# EAGLE design SSR 16 Output_1layer (EAGLE 7.6.0)
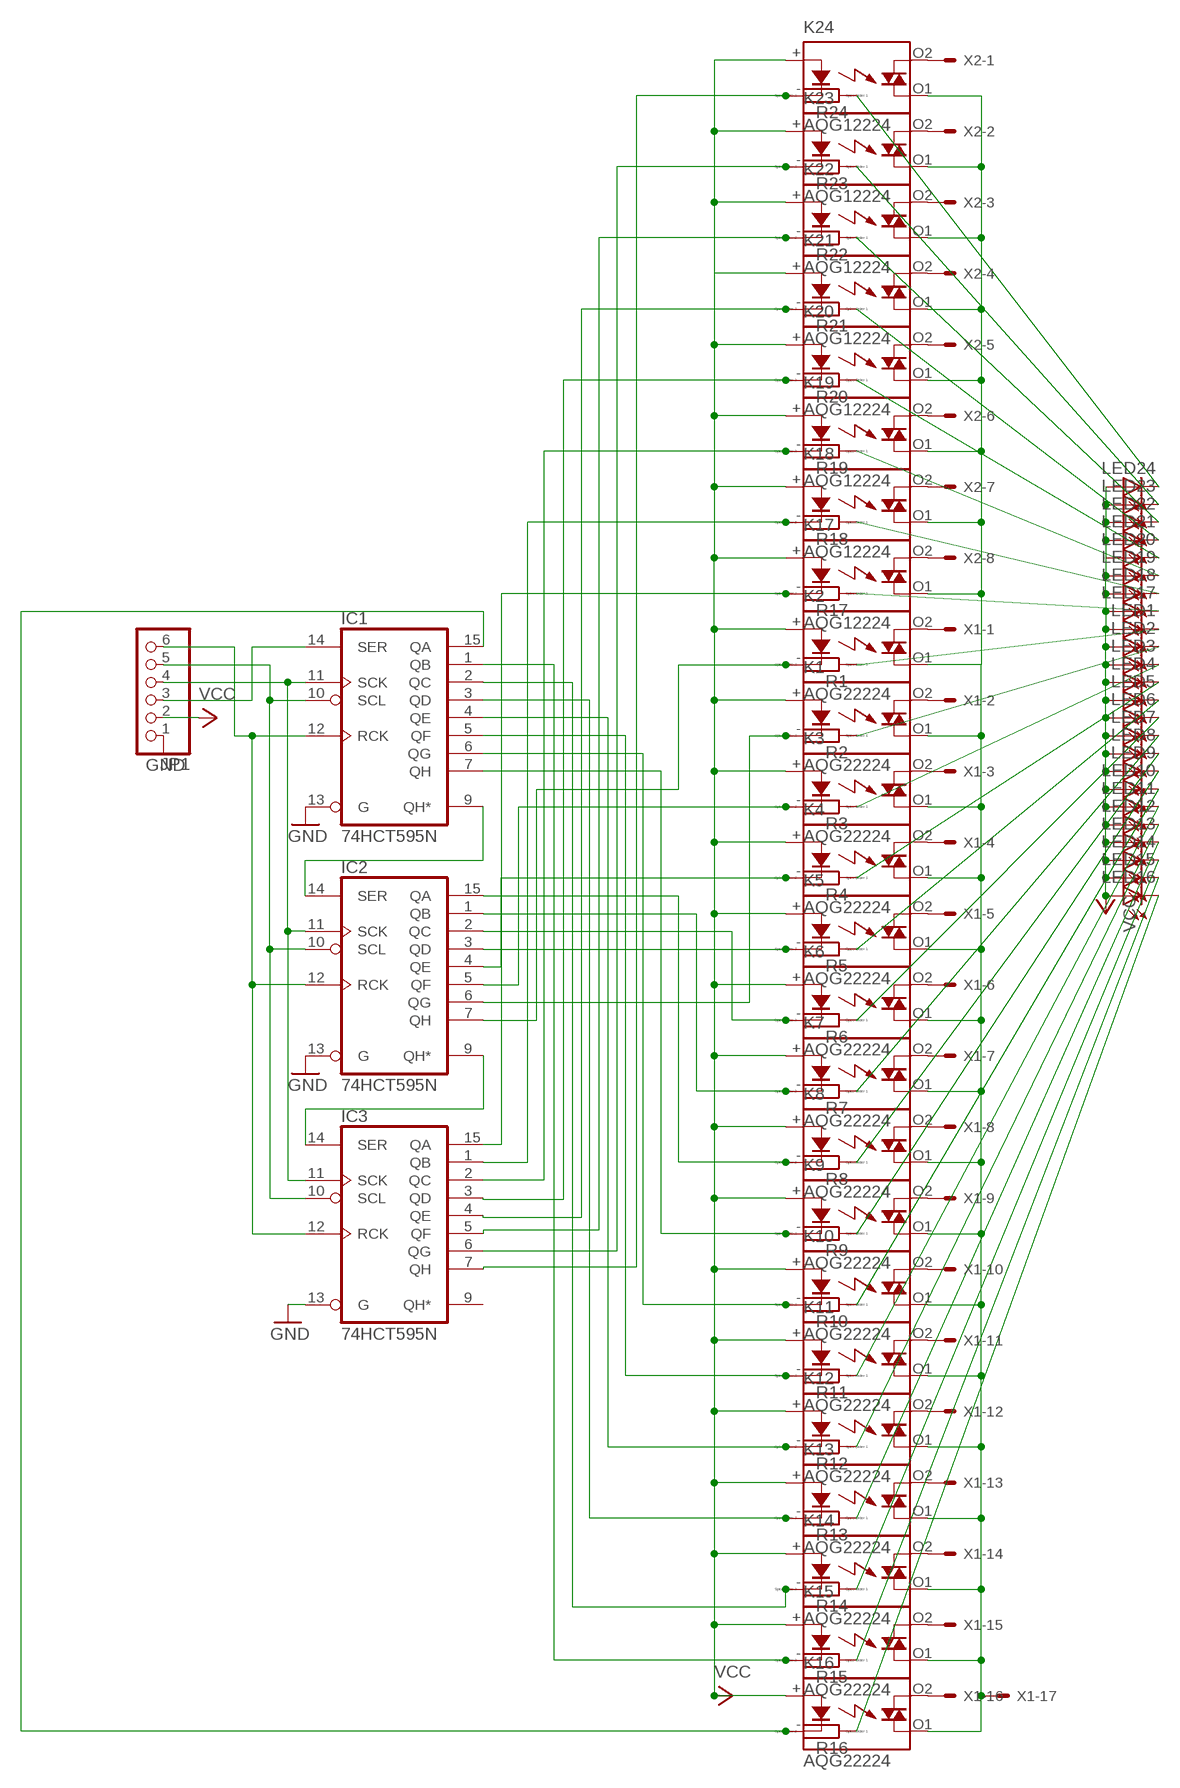
[diagram p0: schematic, sheet 1]

## Parts
IC1  74HCT595N  [DIL16]
IC2  74HCT595N  [DIL16]
IC3  74HCT595N  [DIL16]
JP1  PINHD-1X6  [1X06]
K1  AQG22224  [AQG]
K2  AQG22224  [AQG]
K3  AQG22224  [AQG]
K4  AQG22224  [AQG]
K5  AQG22224  [AQG]
K6  AQG22224  [AQG]
K7  AQG22224  [AQG]
K8  AQG22224  [AQG]
K9  AQG22224  [AQG]
K10  AQG22224  [AQG]
K11  AQG22224  [AQG]
K12  AQG22224  [AQG]
K13  AQG22224  [AQG]
K14  AQG22224  [AQG]
K15  AQG22224  [AQG]
K16  AQG22224  [AQG]
K17  AQG12224  [AQG]
K18  AQG12224  [AQG]
K19  AQG12224  [AQG]
K20  AQG12224  [AQG]
K21  AQG12224  [AQG]
K22  AQG12224  [AQG]
K23  AQG12224  [AQG]
K24  AQG12224  [AQG]
LED1  LED5MM  [LED5MM]
LED2  LED5MM  [LED5MM]
LED3  LED5MM  [LED5MM]
LED4  LED5MM  [LED5MM]
LED5  LED5MM  [LED5MM]
LED6  LED5MM  [LED5MM]
LED7  LED5MM  [LED5MM]
LED8  LED5MM  [LED5MM]
LED9  LED5MM  [LED5MM]
LED10  LED5MM  [LED5MM]
LED11  LED5MM  [LED5MM]
LED12  LED5MM  [LED5MM]
LED13  LED5MM  [LED5MM]
LED14  LED5MM  [LED5MM]
LED15  LED5MM  [LED5MM]
LED16  LED5MM  [LED5MM]
LED17  LED5MM  [LED5MM]
LED18  LED5MM  [LED5MM]
LED19  LED5MM  [LED5MM]
LED20  LED5MM  [LED5MM]
LED21  LED5MM  [LED5MM]
LED22  LED5MM  [LED5MM]
LED23  LED5MM  [LED5MM]
LED24  LED5MM  [LED5MM]
R1  R0204/7  [0204/7]
R2  R0204/7  [0204/7]
R3  R0204/7  [0204/7]
R4  R0204/7  [0204/7]
R5  R0204/7  [0204/7]
R6  R0204/7  [0204/7]
R7  R0204/7  [0204/7]
R8  R0204/7  [0204/7]
R9  R0204/7  [0204/7]
R10  R0204/7  [0204/7]
R11  R0204/7  [0204/7]
R12  R0204/7  [0204/7]
R13  R0204/7  [0204/7]
R14  R0204/7  [0204/7]
R15  R0204/7  [0204/7]
R16  R0204/7  [0204/7]
R17  R0204/7  [0204/7]
R18  R0204/7  [0204/7]
R19  R0204/7  [0204/7]
R20  R0204/7  [0204/7]
R21  R0204/7  [0204/7]
R22  R0204/7  [0204/7]
R23  R0204/7  [0204/7]
R24  R0204/7  [0204/7]
X1  KK-156-17  [KK-156-17]
X2  KK-156-8  [KK-156-8]

## Nets
GND: IC1.13(G) IC2.13(G) IC3.13(G) JP1.1
N$1: IC1.9(QH*) IC2.14(SER)
N$2: IC1.11(SCK) IC2.11(SCK) IC3.11(SCK) JP1.4
N$3: IC1.10(SCL) IC2.10(SCL) IC3.10(SCL) JP1.5
N$4: IC1.12(RCK) IC2.12(RCK) IC3.12(RCK) JP1.6
N$5: LED1.K(C) R1.1
N$6: IC1.15(QA) K16.-(K) R16.2
N$7: IC1.1(QB) K15.-(K) R15.2
N$8: IC1.2(QC) K14.-(K) R14.2
N$9: IC1.3(QD) K13.-(K) R13.2
N$10: IC1.4(QE) K12.-(K) R12.2
N$11: IC1.5(QF) K11.-(K) R11.2
N$12: IC1.6(QG) K10.-(K) R10.2
N$13: IC1.7(QH) K9.-(K) R9.2
N$14: IC2.15(QA) K8.-(K) R8.2
N$15: IC2.1(QB) K7.-(K) R7.2
N$16: IC2.2(QC) K6.-(K) R6.2
N$17: IC2.3(QD) K5.-(K) R5.2
N$18: IC2.4(QE) K4.-(K) R4.2
N$19: IC2.5(QF) K3.-(K) R3.2
N$20: IC2.6(QG) K1.-(K) R2.2
N$21: LED2.K(C) R2.1
N$22: IC1.14(SER) JP1.3
N$23: K1.O1(DS2) K2.O1(DS2) K3.O1(DS2) K4.O1(DS2) K5.O1(DS2) K6.O1(DS2) K7.O1(DS2) K8.O1(DS2) K9.O1(DS2) K10.O1(DS2) K11.O1(DS2) K12.O1(DS2) K13.O1(DS2) K14.O1(DS2) K15.O1(DS2) K16.O1(DS2) K17.O1(DS2) K18.O1(DS2) K19.O1(DS2) K20.O1(DS2) K21.O1(DS2) K22.O1(DS2) K23.O1(DS2) K24.O1(DS2) X1.17
N$24: K16.O2(DS1) X1.16
N$25: K15.O2(DS1) X1.15
N$26: K14.O2(DS1) X1.14
N$27: K13.O2(DS1) X1.13
N$28: K12.O2(DS1) X1.12
N$29: K11.O2(DS1) X1.11
N$30: K10.O2(DS1) X1.10
N$31: K9.O2(DS1) X1.9
N$32: K8.O2(DS1) X1.8
N$33: K7.O2(DS1) X1.7
N$34: K6.O2(DS1) X1.6
N$35: K5.O2(DS1) X1.5
N$36: K4.O2(DS1) X1.4
N$37: K3.O2(DS1) X1.3
N$38: K1.O2(DS1) X1.2
N$39: K2.O2(DS1) X1.1
N$40: IC2.7(QH) K2.-(K) R1.2
N$41: LED3.K(C) R3.1
N$42: LED4.K(C) R4.1
N$43: LED5.K(C) R5.1
N$44: LED6.K(C) R6.1
N$45: LED7.K(C) R7.1
N$46: LED8.K(C) R8.1
N$47: LED9.K(C) R9.1
N$48: LED10.K(C) R10.1
N$49: LED11.K(C) R11.1
N$50: LED12.K(C) R12.1
N$51: LED13.K(C) R13.1
N$52: LED14.K(C) R14.1
N$53: LED15.K(C) R15.1
N$54: LED16.K(C) R16.1
N$60: IC2.9(QH*) IC3.14(SER)
N$61: IC3.15(QA) K17.-(K) R17.2
N$62: LED17.K(C) R17.1
N$63: IC3.1(QB) K18.-(K) R18.2
N$64: LED18.K(C) R18.1
N$65: IC3.2(QC) K19.-(K) R19.2
N$66: LED19.K(C) R19.1
N$67: IC3.3(QD) K20.-(K) R20.2
N$68: LED20.K(C) R20.1
N$69: IC3.4(QE) K21.-(K) R21.2
N$70: LED21.K(C) R21.1
N$71: IC3.5(QF) K22.-(K) R22.2
N$72: LED22.K(C) R22.1
N$73: K17.O2(DS1) X2.8
N$74: K18.O2(DS1) X2.7
N$75: K19.O2(DS1) X2.6
N$76: K20.O2(DS1) X2.5
N$77: K21.O2(DS1) X2.4
N$78: K22.O2(DS1) X2.3
N$79: K23.O2(DS1) X2.2
N$80: K24.O2(DS1) X2.1
N$82: IC3.6(QG) K23.-(K) R23.2
N$83: IC3.7(QH) K24.-(K) R24.2
N$84: LED23.K(C) R23.1
N$85: LED24.K(C) R24.1
VCC: JP1.2 K1.+(A) K2.+(A) K3.+(A) K4.+(A) K5.+(A) K6.+(A) K7.+(A) K8.+(A) K9.+(A) K10.+(A) K11.+(A) K12.+(A) K13.+(A) K14.+(A) K15.+(A) K16.+(A) K17.+(A) K18.+(A) K19.+(A) K20.+(A) K21.+(A) K22.+(A) K23.+(A) K24.+(A) LED1.A LED2.A LED3.A LED4.A LED5.A LED6.A LED7.A LED8.A LED9.A LED10.A LED11.A LED12.A LED13.A LED14.A LED15.A LED16.A LED17.A LED18.A LED19.A LED20.A LED21.A LED22.A LED23.A LED24.A
Unconnected: IC3.9(QH*)

## Power pins joined to a net without a drawn wire
GND: IC1.8(GND) IC2.8(GND) IC3.8(GND)
VCC: IC1.16(VCC) IC2.16(VCC) IC3.16(VCC)

## Library data of the parts
IC1-IC3 = 74xx-eu:74*595: 8-bit SHIFT REGISTER, output latch
JP1 = pinhead:PINHD-1X6: PIN HEADER
K1-K16 = relay:AQG*: SOLID STATE RELAY NAiS Zero-cross, Non zero-cross Source: http://www.mew-europe.com/.. en_ds_61611_0000.pdf; MPN: AQG22224; OC_FARNELL: unknown; OC_NEWARK: 11N2589
K17-K24 = relay:AQG*: SOLID STATE RELAY NAiS Zero-cross, Non zero-cross Source: http://www.mew-europe.com/.. en_ds_61611_0000.pdf; MPN: AQG12224; OC_FARNELL: unknown; OC_NEWARK: 11N2584
LED1-LED24 = led:LED: LED OSRAM: - CHIPLED LG R971, LG N971, LY N971, LG Q971, LY Q971, LO R971, LY R971 LH N974, LH R974 LS Q976, LO Q976, LY Q976 LO Q996 - Hyper CHIPLED LW Q18S LB Q993, LB Q99A, LB R99A - SideLED LS A670, LO A670, LY A670, LG A670, LP A670 LB A673, LV A673, LT A673, LW A673 LH A674 LY A675 LS A676, LA A676, LO A676, LY A676, LW A676 LS A679, LY A679, LG A679 - Hyper Micro SIDELED® LS Y876, LA Y876, LO Y876, LY Y876 LT Y87S - SmartLED LW L88C, LW L88S LB L89C, LB L89S, LG L890 LS L89K, LO L89K, LY L89K LS L896, LA L896, LO L896, LY L896 - TOPLED LS T670, LO T670, LY T670, LG T670, LP T670 LSG T670, LSP T670, LSY T670, LOP T670, LYG T670 LG T671, LOG T671, LSG T671 LB T673, LV T673, LT T673, LW T673 LH T674 LS T676, LA T676, LO T676, LY T676, LB T676, LH T676, LSB T676, LW T676 LB T67C, LV T67C, LT T67C, LS T67K, LO T67K, LY T67K, LW E67C LS E67B, LA E67B, LO E67B, LY E67B, LB E67C, LV E67C, LT E67C LW T67C LS T679, LY T679, LG T679 LS T770, LO T770, LY T770, LG T770, LP T770 LB T773, LV T773, LT T773, LW T773 LH T774 LS E675, LA E675, LY E675, LS T675 LS T776, LA T776, LO T776, LY T776, LB T776 LHGB T686 LT T68C, LB T68C - Hyper Mini TOPLED® LB M676 - Mini TOPLED Santana® LG M470 LS M47K, LO M47K, LY M47K Source: http://www.osram.convergy.de LUXEON: - LUMILED® LXK2-PW12-R00, LXK2-PW12-S00, LXK2-PW14-U00, LXK2-PW14-V00 LXK2-PM12-R00, LXK2-PM12-S00, LXK2-PM14-U00 LXK2-PE12-Q00, LXK2-PE12-R00, LXK2-PE12-S00, LXK2-PE14-T00, LXK2-PE14-U00 LXK2-PB12-K00, LXK2-PB12-L00, LXK2-PB12-M00, LXK2-PB14-N00, LXK2-PB14-P00, LXK2-PB14-Q00 LXK2-PR12-L00, LXK2-PR12-M00, LXK2-PR14-Q00, LXK2-PR14-R00 LXK2-PD12-Q00, LXK2-PD12-R00, LXK2-PD12-S00 LXK2-PH12-R00, LXK2-PH12-S00 LXK2-PL12-P00, LXK2-PL12-Q00, LXK2-PL12-R00 Source: www.luxeon.com KINGBRIGHT: KA-3528ASYC Source: www.kingbright.com
R1-R24 = eagle-ltspice:R: RESISTOR, European symbol; SPICEMODEL: NONE; SPICEPREFIX: R
X1 = con-molex:KK-156-17: KK 156 HEADER Source: http://www.molex.com/pdm_docs/sd/026604100_sd.pdf; OC_FARNELL: unknown; OC_NEWARK: unknown
X2 = con-molex:KK-156-8: KK 156 HEADER Source: http://www.molex.com/pdm_docs/sd/026604100_sd.pdf; OC_FARNELL: unknown; OC_NEWARK: unknown

## Board
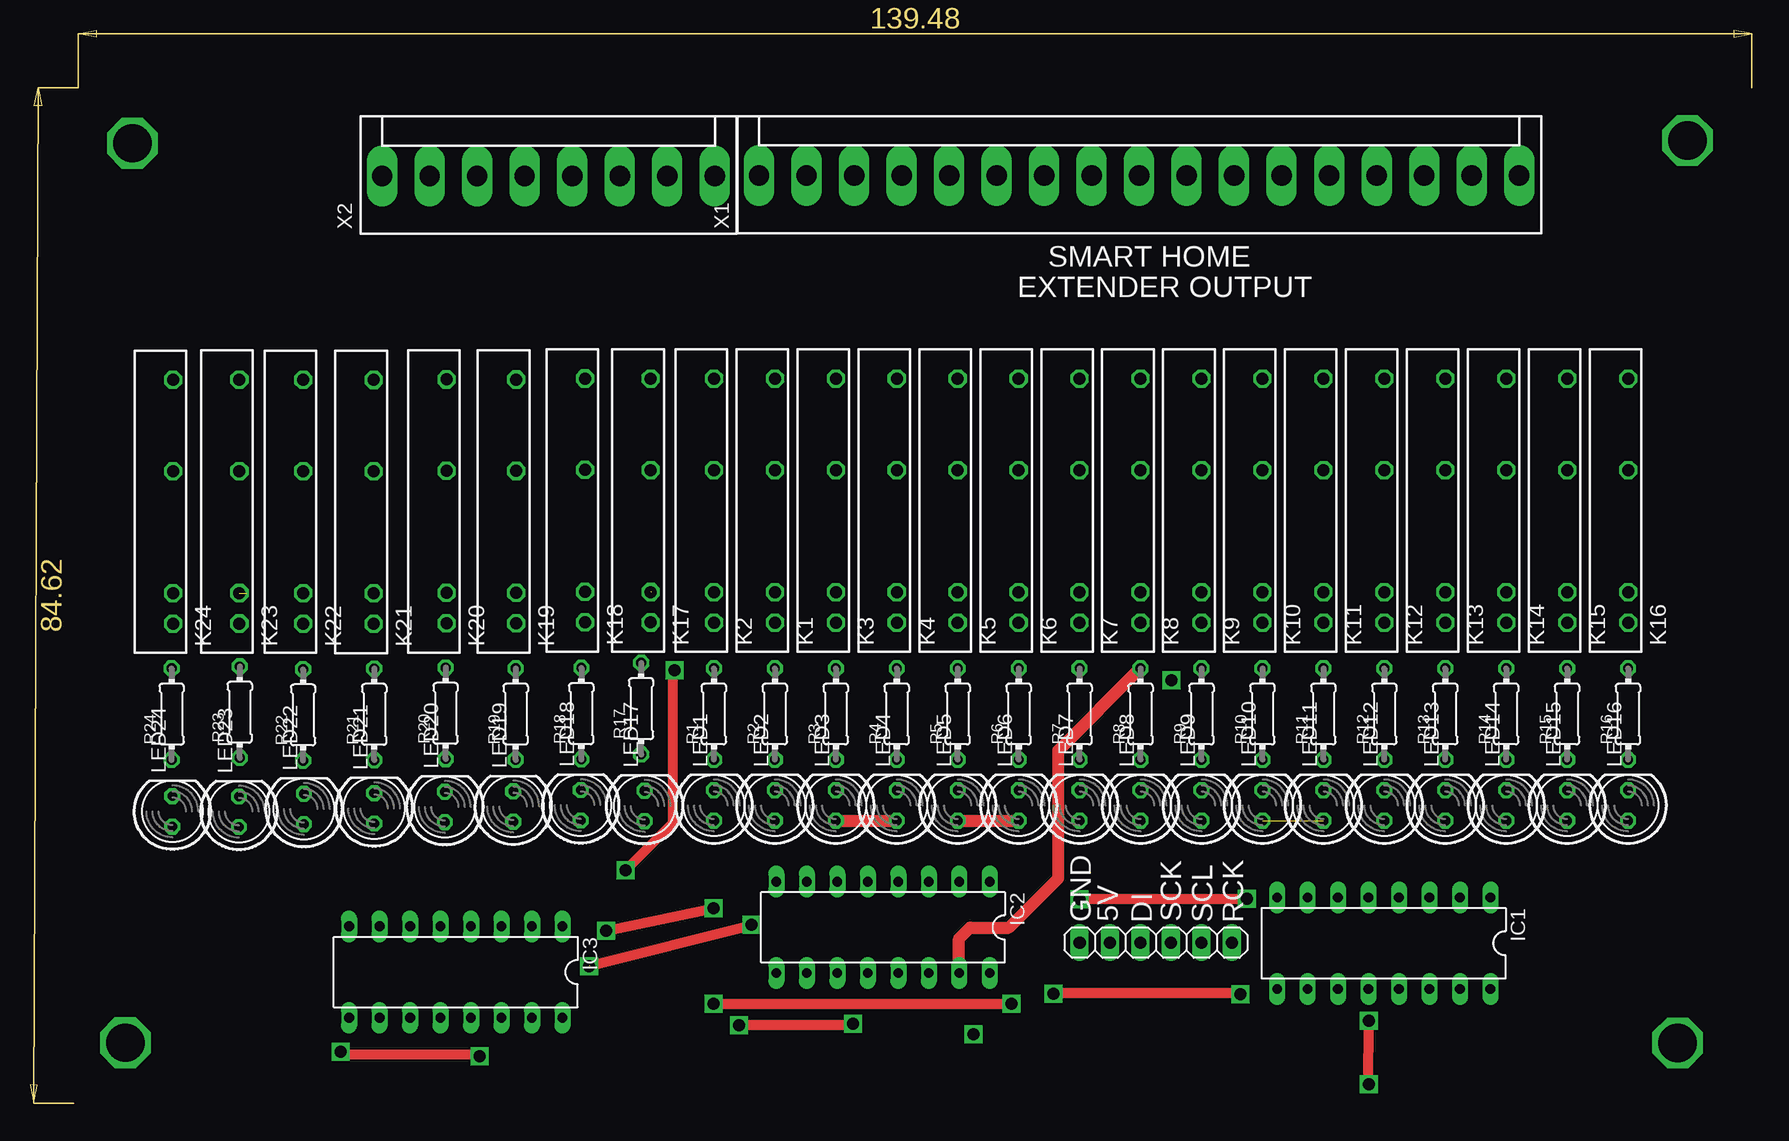
[diagram p1: board, top side]
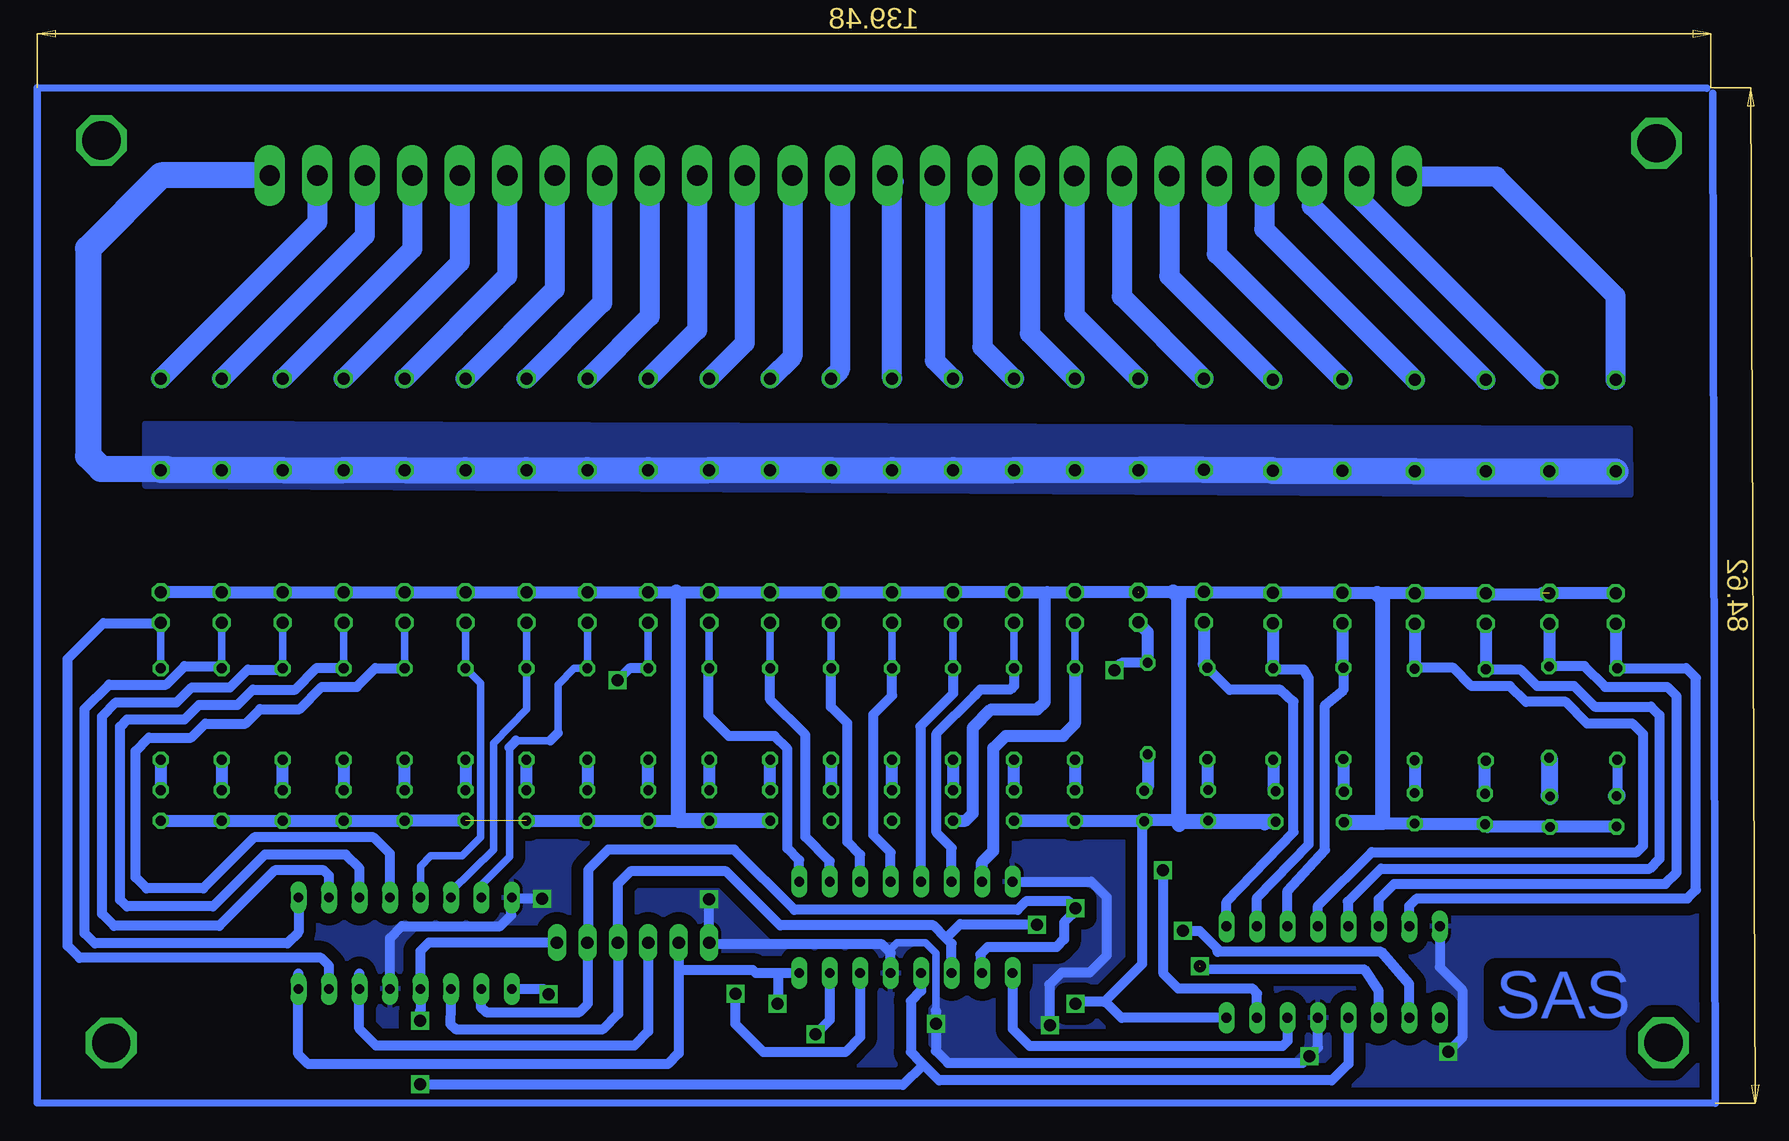
[diagram p2: board, bottom side, seen from below]

Size 143.51 x 89.43 mm. Coordinates in mm from the lower left corner, seen from the top.
Copper layers (1*16): Top 0.035mm / dielectric 1.5mm / Bottom 0.035mm
Design rules "default": minimum track width 10mil, minimum drill 24mil, track to track 8mil, track to pad 8mil, pad to pad 8mil, via to via 8mil, smd to smd 8mil, copper to edge 40mil, drill to drill 8mil, minimum pad ring 10mil, minimum via ring 8mil, stop-mask expansion 4mil, vias tented up to drill 0mil, thermal gap 10mil

### Footprints (pad centres in the part's own frame; a part is rotated, then mirrored left to right if it is on the bottom)
DIL16 = drill 0.813 long: 1 -8.89,-3.81; 2 -6.35,-3.81; 3 -3.81,-3.81; 4 -1.27,-3.81; 5 1.27,-3.81; 6 3.81,-3.81; 7 6.35,-3.81; 8 8.89,-3.81; 9 8.89,3.81; 10 6.35,3.81; 11 3.81,3.81; 12 1.27,3.81; 13 -1.27,3.81; 14 -3.81,3.81; 15 -6.35,3.81; 16 -8.89,3.81
1X06 = drill 1.016 long: 1 -6.35,0; 2 -3.81,0; 3 -1.27,0; 4 1.27,0; 5 3.81,0; 6 6.35,0
AQG = drill 1 octagon: + -7.62,0; - -10.16,0; O1 2.54,0; O2 10.16,0
LED5MM = drill 0.813 octagon: A -1.27,0; K 1.27,0
0204/7 = drill 0.813 octagon: 1 -3.81,0; 2 3.81,0
KK-156-17 = drill 1.7 pad 2.184 long: 1 -31.68,0; 2 -27.72,0; 3 -23.76,0; 4 -19.8,0; 5 -15.84,0; 6 -11.88,0; 7 -7.92,0; 8 -3.96,0; 9 0,0; 10 3.96,0; 11 7.92,0; 12 11.88,0; 13 15.84,0; 14 19.8,0; 15 23.76,0; 16 27.72,0; 17 31.68,0
KK-156-8 = drill 1.7 pad 2.184 long: 1 -13.86,0; 2 -9.9,0; 3 -5.94,0; 4 -1.98,0; 5 1.98,0; 6 5.94,0; 7 9.9,0; 8 13.86,0

### Placement (x,y rotation side)
IC1  112.84,13.33 180 top
IC2  71.11,14.65 180 top
IC3  35.49,10.93 180 top
JP1  93.84,13.38 0 top
K1  62.09,50.21 90 top
K2  57.01,50.21 90 top
K3  67.17,50.21 90 top
K4  72.25,50.21 90 top
K5  77.33,50.21 90 top
K6  82.41,50.21 90 top
K7  87.49,50.21 90 top
K8  92.57,50.21 90 top
K9  97.65,50.21 90 top
K10  102.73,50.21 90 top
K11  107.81,50.21 90 top
K12  112.89,50.21 90 top
K13  117.97,50.21 90 top
K14  123.05,50.21 90 top
K15  128.13,50.21 90 top
K16  133.21,50.21 90 top
K17  51.74,50.22 90 top
K18  46.26,50.23 90 top
K19  40.53,50.14 90 top
K20  34.71,50.15 90 top
K21  28.66,50.11 90 top
K22  22.77,50.12 90 top
K23  17.46,50.13 90 top
K24  11.93,50.12 90 top
LED1  57.01,24.81 90 top
LED2  62.09,24.81 90 top
LED3  67.17,24.81 90 top
LED4  72.25,24.81 90 top
LED5  77.33,24.81 90 top
LED6  82.41,24.81 90 top
LED7  87.49,24.81 90 top
LED8  92.57,24.81 90 top
LED9  97.65,24.81 90 top
LED10  102.73,24.81 90 top
LED11  107.81,24.81 90 top
LED12  112.89,24.81 90 top
LED13  117.97,24.81 90 top
LED14  123.05,24.81 90 top
LED15  128.13,24.81 90 top
LED16  133.21,24.81 90 top
LED17  51.23,24.78 90 top
LED18  45.91,24.83 90 top
LED19  40.28,24.73 90 top
LED20  34.59,24.69 90 top
LED21  28.69,24.57 90 top
LED22  22.83,24.52 90 top
LED23  17.41,24.29 90 top
LED24  11.87,24.32 90 top
R1  57.01,32.43 90 top
R2  62.09,32.43 90 top
R3  67.17,32.43 90 top
R4  72.25,32.43 90 top
R5  77.33,32.43 90 top
R6  82.41,32.43 90 top
R7  87.49,32.43 90 top
R8  92.57,32.43 90 top
R9  97.65,32.43 90 top
R10  102.73,32.43 90 top
R11  107.81,32.43 90 top
R12  112.89,32.43 90 top
R13  117.97,32.43 90 top
R14  123.05,32.43 90 top
R15  128.13,32.43 90 top
R16  133.21,32.43 90 top
R17  50.94,32.89 90 top
R18  45.96,32.47 90 top
R19  40.49,32.43 90 top
R20  34.65,32.48 90 top
R21  28.7,32.4 90 top
R22  22.77,32.35 90 top
R23  17.48,32.59 90 top
R24  11.81,32.43 90 top
X1  92.45,77.31 0 top
X2  43.21,77.28 0 top

### Tracks (layer width: path | path; a pad name or v marks a point on that pad's centre or on a via)
GND  (via drill 1)
  Top 0.813: v87.49,16.98 87.45,17.02 v101.43,17.02 | v25.9,4.27 25.9,4.2 26.01,4.09 37.3,4.09 v37.48,3.92 | v59.1,6.48 59.15,6.48 59.19,6.52 68.51,6.52 v68.6,6.62
  Bottom 0.61: 72.38,12.53 72.38,12.82 71.83,13.37 69.47,13.37 68.6,12.5 68.6,7.73
  Bottom 0.813: IC1.13 114.11,13.75 113.12,14.75 104.91,14.75 104,15.67 104,17.09 IC1.8 103.83,17.02 v101.43,17.02 | IC2.13 72.38,12.53 73.08,13.23 87.34,13.23 JP1.1 v87.49,16.98 | 68.6,7.73 68.6,7.15 v68.6,6.62 68.6,4.36 67.61,3.37 38.03,3.37 v37.48,3.92 36.75,4.64 36.75,7.11 IC3.13 | IC3.8 26.6,11.33 24.72,9.45 24.72,5.45 v25.9,4.27 | IC2.8 55.65,18.46 54.39,17.2 54.39,12.3 55.8,10.89 58.13,10.89 59.15,9.87 59.15,6.52 v59.1,6.48
  pour Bottom (isolate 1.016): 4.03,43.76 143.36,43.81 143.36,-0.29 3.63,-0.29 3.63,43.82
N$1  (via drill 1)
  Top 0.813: v100.91,9.09 100.98,9.16 85.33,9.16 v85.29,9.12
  Bottom 0.813: v85.29,9.12 85.33,9.16 85.33,6.61 82.98,4.26 76.16,4.26 74.92,5.5 IC2.14 | IC1.9 101.34,9.52 v100.91,9.09
N$2  (via drill 1)  (1 unrouted)
  Top 0.813: 46.63,11.44 60.12,14.82 v60.16,14.86
  Bottom 0.813: IC1.11 109.08,6.6 108.65,6.17 96.35,6.17 95.07,7.45 95.11,7.49 JP1.4 | IC2.11 67.3,13.3 67.75,13.75 | 67.75,13.75 68.81,14.81 81.58,14.81 86.08,19.32 94.06,19.32 95.12,18.26 JP1.4 | 95.26,13.53 JP1.4 | IC3.11 31.68,9.34 32.89,11.14 46.45,11.11 v46.6,11.41 | 66.59,14.92 66.65,14.86 | 66.65,14.86 67.75,13.75 | v60.16,14.86 66.65,14.86
N$3  (via drill 1)
  Top 0.813: v48.01,14.38 v56.97,16.25
  Bottom 0.813: IC1.10 106.54,8.02 106.11,7.58 98.31,7.58 97.6,8.29 97.6,13.33 JP1.5 97.59,13.45 97.59,19.45 95.91,21.12 85.42,21.12 80.4,16.1 61.8,16.1 61.04,16.86 57.57,16.86 v56.97,16.25 56.85,16.14 57.91,15.08 57.91,13.66 58.55,13.02 64.28,13.02 64.91,12.39 64.91,10.99 IC2.10 | IC3.10 29.14,9.92 31.48,12.61 45.13,12.61 45.13,12.86 46.6,14.34 47.98,14.34 v48.01,14.38
N$4  (via drill 1)
  Top 0.813: v111.61,1.58 111.56,1.53 v111.59,6.88
  Bottom 0.813: JP1.6 110.88,13.38 111.57,12.69 IC1.12 111.57,7.71 111.61,7.67 v111.59,6.88 | 69.84,3.41 69.84,3.2 | v111.61,1.58 111.56,1.53 71.34,1.53 69.65,3.22 | IC3.12 34.22,3.28 35.6,1.9 68.33,1.9 69.65,3.22 | 69.65,3.22 69.68,3.26 69.84,3.41 | IC2.12 69.84,9.35 70.69,8.5 70.69,4.27 69.84,3.41
N$5
  Bottom 1.016: R1.1 LED1.K
N$6
  Bottom 0.61: K16.- R16.2
  Bottom 0.813: IC1.15 119.19,11.45 119.86,12.12 139.98,12.12 140.97,13.11 140.97,37.03 138,40 133.26,40 K16.-
N$7
  Bottom 0.61: R15.2 K15.-
  Bottom 0.813: IC1.1 121.73,14.26 122.67,13.32 138.71,13.32 139.56,14.16 139.56,32.86 137.53,34.89 132.77,34.89 131.23,36.43 128.32,36.43 R15.2
N$8
  Bottom 0.61: K14.- R14.2
  Bottom 0.813: IC1.2 119.19,18.96 119.63,19.4 123.72,19.4 128.34,14.79 137.11,14.79 138.11,15.79 138.11,32.24 136.96,33.39 131.89,33.39 130.63,34.66 127.43,34.66 125.97,36.12 123.17,36.12 R14.2
N$9
  Bottom 0.61: R13.2 K13.-
  Bottom 0.813: IC1.3 116.65,19.57 117.8,20.72 124.53,20.72 128.85,16.4 136.05,16.4 136.6,16.95 136.6,31.39 136.01,31.98 131.23,31.98 130.02,33.19 126.81,33.19 125.54,34.46 122.01,34.46 120.2,36.27 118,36.27 R13.2
N$10
  Bottom 0.61: K12.- R12.2
  Bottom 0.813: IC1.4 114.11,20.79 115.47,22.16 125.41,22.16 129.66,17.9 134.4,17.9 135.32,18.82 135.32,29.34 134.2,30.46 130.68,30.46 129.51,31.63 126.14,31.63 124.94,32.83 121.65,32.83 119.79,34.7 116.88,34.7 115.33,36.25 R12.2
N$11
  Bottom 0.61: K11.- R11.2 106.55,34.98 106.55,22.14 108.08,20.61 110.71,20.61 111.57,19.75 IC1.5
N$12
  Bottom 0.61: K10.- R10.2 | 109.03,17.68 105.45,21.13 105.45,29.98 102.74,32.82 R10.2
  Bottom 0.813: IC1.6 109.03,17.68 | R10.2
N$13
  Bottom 0.61: K9.- R9.2 98.75,36.24 100.1,34.89 100.1,30.85 | 100.75,30.21 103.6,30.21 | 104.15,29.65 104.15,20.54 106.48,18.22 106.48,17.15
  Bottom 0.813: 100.1,30.85 100.75,30.21 | 103.6,30.21 104.15,29.65 | 106.48,17.15 IC1.7
N$14  (via drill 1)
  Top 0.813: v78.65,5.73 78.69,5.73 | v95.15,35.25 95.19,35.25 95.27,35.17
  Top 1.016: IC2.15 77.46,13.72 78.37,14.64 81.58,14.64 85.71,18.77 85.71,29.38 R8.2
  Bottom 0.61: K8.- R8.2
  Bottom 0.813: IC2.15 77.46,6.92 v78.65,5.73 | R8.2 94.16,36.24 v95.15,35.25
N$15
  Bottom 0.61: R7.2 K7.-
  Bottom 0.813: IC2.1 80,20.25 80.97,21.23 80.97,29.52 82.04,30.59 85.86,30.59 87.56,32.29 87.56,36.17 R7.2
N$16
  Bottom 0.61: R6.2 K6.-
  Bottom 0.813: IC2.2 77.46,20.17 79.49,22.2 79.49,30.69 82.43,33.63 82.43,36.23 R6.2
N$17
  Bottom 0.61: K5.- R5.2
  Bottom 0.813: IC2.3 74.92,20.72 75.99,21.79 75.99,31.67 77.35,33.03 77.35,36.22 R5.2
N$18
  Bottom 0.61: K4.- R4.2
  Bottom 0.813: IC2.4 72.38,20.91 73.81,22.34 73.81,32.4 72.25,33.96 R4.2
N$19
  Bottom 0.61: K3.- R3.2
  Bottom 0.813: R3.2 67.17,34.13 69.9,31.4 69.9,18.53 IC2.5
N$20
  Bottom 0.61: K1.- R2.2
  Bottom 0.813: IC2.6 67.3,21.29 68.55,22.54 68.55,30.82 65.4,33.97 65.03,34.34 64.91,34.46 62.41,34.46 62.09,34.78 R2.2
N$21
  Bottom 1.016: LED2.K R2.1
N$22
  Bottom 0.813: JP1.3 92.57,5.98 93.75,4.8 115.26,4.8 116.68,6.21 116.68,10.81 IC1.14
N$23
  Bottom 1.422: 56.99,52.77 K2.O1
  Bottom 2.184: 132.58,52.75 K15.O1 K14.O1 K13.O1 K12.O1 K11.O1 K10.O1 K9.O1 K8.O1 K7.O1 K6.O1 K5.O1 K4.O1 K3.O1 K1.O1 K2.O1 K17.O1 51.73,52.77 K18.O1 40.62,52.77 K19.O1 K20.O1 | 132.58,52.75 K16.O1 | K20.O1 | K20.O1 28.69,52.68 K21.O1 11.94,52.65 K24.O1 | X1.17 133.18,77.31 139.28,71.21 139.28,53.95 138.18,52.85 132.68,52.85 132.58,52.75
  pour Bottom: 10.77,50.73 134.48,51.48 134.48,56.56 10.79,56.18
N$24
  Bottom 1.676: X1.16 120.17,73.41 K16.O2
N$25
  Bottom 1.676: X1.15 116.21,72.29 K15.O2
N$26
  Bottom 1.676: X1.14 112.25,71.17 K14.O2
N$27
  Bottom 1.676: X1.13 108.29,70.05 K13.O2
N$28
  Bottom 1.676: X1.12 104.33,68.93 K12.O2
N$29
  Bottom 1.676: X1.11 100.37,67.81 K11.O2
N$30
  Bottom 1.676: X1.10 96.41,66.69 K10.O2
N$31
  Bottom 1.676: X1.9 92.45,65.57 K9.O2
N$32
  Bottom 1.676: X1.8 88.49,64.45 K8.O2
N$33
  Bottom 1.676: X1.7 84.53,63.33 K7.O2
N$34
  Bottom 1.676: X1.6 80.57,62.21 K6.O2
N$35
  Bottom 1.676: X1.5 76.61,61.09 K5.O2
N$36
  Bottom 1.422: 72.25,76.91 X1.4
  Bottom 1.676: 72.13,76.79 X1.4 | K4.O2 72.25,76.91
N$37
  Bottom 1.676: X1.3 68.69,61.89 K3.O2
N$38
  Bottom 1.676: X1.2 64.73,63.01 K1.O2
N$39
  Bottom 1.676: X1.1 60.77,64.13 K2.O2
N$40
  Bottom 0.61: K2.- R1.2
  Bottom 1.016: R1.2 57.01,31.6 58,30.62 62.77,30.62 63.8,29.59 63.8,21.03 64.76,20.07 IC2.7
N$41
  Bottom 1.016: R3.1 LED3.K
N$42
  Bottom 1.016: LED4.K R4.1
N$43
  Bottom 1.016: R5.1 LED5.K
N$44
  Bottom 1.016: LED6.K R6.1
N$45
  Bottom 1.016: R7.1 LED7.K
N$46
  Bottom 1.016: LED8.K R8.1
N$47
  Bottom 1.016: R9.1 LED9.K
N$48
  Bottom 1.016: LED10.K R10.1
N$49
  Bottom 1.016: R11.1 LED11.K
N$50
  Bottom 1.016: LED12.K R12.1
N$51
  Bottom 1.016: R13.1 LED13.K
N$52
  Bottom 1.016: LED14.K R14.1
N$53
  Bottom 1.016: R15.1 LED15.K
N$54
  Bottom 1.016: R16.1 LED16.K
N$55
  Bottom 0.61: 4.36,84.57 143.51,84.62 143.51,0.03 3.64,0 3.85,84.16
N$56  (via drill 3.2 pad 2.54)
  other vias: 8.54,80
N$57  (via drill 3.2 pad 2.54)
  other vias: 7.95,5.04
N$58  (via drill 3.2 pad 2.54)
  other vias: 137.34,5.02
N$59  (via drill 3.2 pad 2.54)
  other vias: 138.16,80.23
N$60
  Bottom 0.813: 62.23,10.83 IC2.9 | 62.03,10.66 IC2.9 | IC3.14 39.3,5.16 39.7,4.76 60.78,4.76 62.19,6.17 62.19,10.81 IC2.9
N$61  (via drill 1)
  Top 0.813: 49.67,19.47 v49.67,19.43 53.56,23.32 53.56,36.03 53.62,36.09 v53.73,36.09
  Bottom 0.813: IC3.15 41.84,9.14 42.24,9.54 48.4,9.54 49.63,10.77 49.63,19.39 v49.67,19.43 | R17.2 53.12,36.7 v53.73,36.09
  Bottom 1.016: R17.2 50.94,39.26 K17.-
N$62
  Bottom 1.016: R17.1 50.94,26.33 LED17.K
N$63
  Bottom 0.813: IC3.1 44.38,16.78 38.79,22.59 38.79,33.46 39.87,34.45 44.13,34.45 R18.2
  Bottom 1.016: K18.- 46.26,36.58 R18.2
N$64
  Bottom 1.016: R18.1 45.96,26.16 LED18.K
N$65
  Bottom 0.813: IC3.2 41.84,17.13 37.53,21.57 37.53,35.43 37.94,36.13 40.38,36.13 R19.2
  Bottom 1.016: K19.- 40.53,36.28 R19.2
N$66
  Bottom 1.016: R19.1 40.49,26.2 LED19.K
N$67
  Bottom 0.813: IC3.3 39.3,17.71 36.17,21.11 36.17,33.17 34.61,34.46 34.61,36.26 R20.2
  Bottom 1.016: K20.- 34.71,36.36 R20.2
N$68
  Bottom 1.016: R20.1 34.65,26.02 LED20.K
N$69
  Bottom 0.813: IC3.4 36.76,16.45 32.28,20.93 10.17,20.93 9.65,21.44 9.65,30.75 10.56,31.66 14.33,31.66 16.11,33.45 19.43,33.45 20.75,34.76 23.95,34.76 25.46,36.27 28.63,36.27 R21.2
  Bottom 1.016: K21.- 28.66,36.25 R21.2
N$70
  Bottom 1.016: R21.1 LED21.K
N$71
  Bottom 0.813: R22.2 19.9,36.16 18.51,34.77 15.42,34.77 13.7,33.04 9,33.04 8.3,32.34 8.3,20.36 9.11,19.56 31.51,19.56 34.26,16.8 34.26,14.78 IC3.5
  Bottom 1.016: K22.- R22.2
N$72
  Bottom 1.016: LED22.K 22.83,28.48 R22.1
N$73
  Bottom 1.676: X2.8 57.07,65.71 K17.O2
N$74
  Bottom 1.676: X2.7 53.11,67.24 K18.O2
N$75
  Bottom 1.676: X2.6 49.15,68.93 K19.O2
N$76
  Bottom 1.676: X2.5 45.19,70.79 K20.O2
N$77
  Bottom 1.676: X2.4 41.23,72.84 K21.O2
N$78
  Bottom 1.676: X2.3 37.27,74.78 K22.O2
N$79
  Bottom 1.422: K23.O2 18.17,60.29 | 33.39,77.21 X2.2
  Bottom 1.676: 18.17,60.29 33.39,75.51 33.39,77.21
N$80
  Bottom 1.422: 29.29,77.22 X2.1
  Bottom 1.676: K24.O2 11.93,67.26 21.88,77.22 29.29,77.22
N$82
  Bottom 0.813: IC3.6 31.68,17.01 30.41,18.28 7.78,18.28 6.86,19.2 6.86,33.91 7.65,34.69 12.81,34.69 14.54,36.42 17.46,36.42 R23.2
  Bottom 1.016: K23.- 17.46,36.43 R23.2
N$83
  Bottom 0.813: IC3.7 29.14,16.44 28.5,17.07 5.95,17.07 5.25,17.77 5.25,35.44 6.07,36.27 11.78,36.27 R24.2
  Bottom 1.016: K24.- 11.93,36.36 R24.2
N$84
  Bottom 1.422: R23.1 17.48,25.63 LED23.K
N$85
  Bottom 0.813: R24.1 11.81,25.65
  Bottom 1.422: 11.81,25.65 LED24.K
VCC  (via drill 1)  (3 unrouted)
  Top 0.813: v56.98,8.3 81.78,8.3 v81.8,8.28
  Top 1.016: LED3.A LED4.A | LED5.A LED6.A
  Bottom 0.813: JP1.2 90.03,10.97 | 90.03,10.97 90.03,4.15 90.93,3.26 120.91,3.26 121.75,4.09 121.75,10.8 IC1.16 | IC2.16 82.01,10.84 | 82.01,10.84 83.6,10.84 83.86,11.1 89.91,11.1 90.03,10.97 | v81.8,8.28 81.8,8.35 81.73,8.42 81.73,10.57 82.01,10.84 | 51.6,23.54 51.43,23.37 51.43,11.59 54.51,8.5 | 54.51,8.5 54.58,8.44 56.85,8.44 v56.98,8.3 | IC3.16 53.13,7.12 54.51,8.5
  Bottom 1.016: K16.+ K15.+ K14.+ K13.+ K12.+ K11.+ K10.+ K9.+ K8.+ 90.23,42.59 K7.+ K6.+ K5.+ K4.+ K3.+ K1.+ 59.32,42.59 | 59.32,42.59 K2.+ K17.+ | 51.76,42.61 48.81,42.61 K18.+ 46.18,42.52 K19.+ K20.+ 34.68,42.49 31.83,42.49 K21.+ 28.65,42.5 K22.+ 22.64,42.37 18.2,42.37 18.06,42.5 K24.+ | LED16.A LED15.A LED14.A LED13.A LED12.A LED11.A | LED10.A LED9.A LED8.A LED7.A LED6.A | 56.95,23.48 LED1.A | LED1.A LED2.A 51.6,23.54 | LED1.A 56.98,23.51 LED17.A 51.18,23.56 LED18.A 45.8,23.46 41.18,23.46 | LED19.A 41.18,23.46 | 41,23.42 41.18,23.24 41.18,23.46 | LED20.A 34.47,23.3 LED21.A 28.64,23.25 LED22.A 22.6,23.02 LED23.A 17.38,23.05 LED24.A | LED3.A 66.13,23.54 65.52,24.15 65.52,31.28 63.99,32.81 60.17,32.81 59.52,33.45 59.52,42.39 59.32,42.59
  Bottom 1.27: LED20.A 31.39,23.42 31.35,23.39 31.35,42.01 31.83,42.49 | LED19.A 48.11,23.46 48.34,23.23 48.34,42.13 48.81,42.61 | LED6.A 90.03,23.54 90.04,23.56 90.04,42.4 90.23,42.59

### Text on the board
Bottom: SAS
tPlace: SMART HOME | EXTENDER OUTPUT | GND | 5V | DI | SCK | SCL | RCK
tOrigins: 16 | 1 | L | SAS SMART DEVICE